# Altium schematic sheet Controller-Board.SchDoc
size Legal; PageSetup: Record=PageOptions|CenterHorizontal=True|CenterVertical=True|PrintScale=0.77|XCorrection=1.00|YCorrection=1.00|PrintKind=1|BorderSize=5000000|LeftOffset=0|BottomOffset=0|Orientation=2|PaperLength=1000|PaperWidth=1000|Scale=100|PaperSource=7|PrintQuality=-3|MediaType=1|DitherType=10|PrintScaleMode=1|PaperKind=Letter|PaperIndex=1
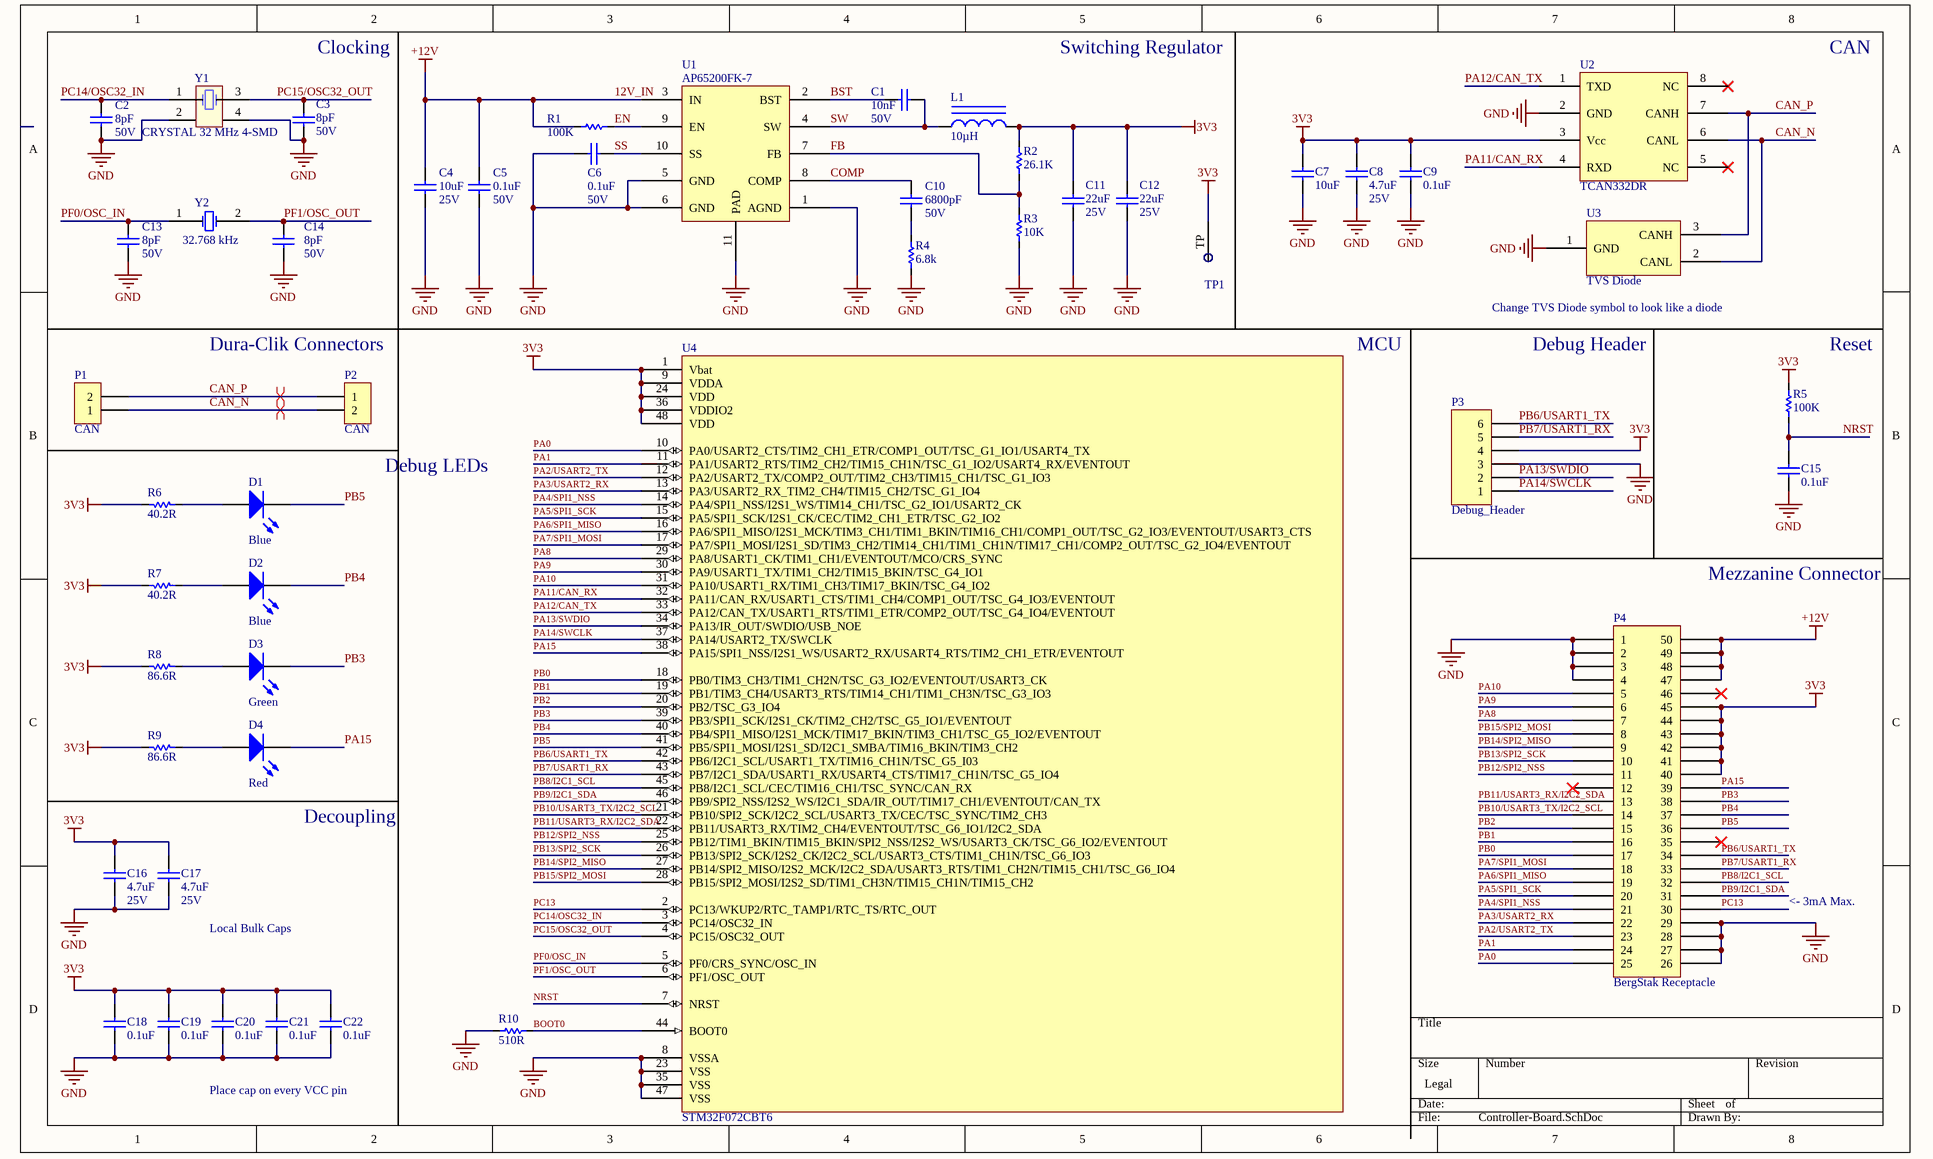
[diagram p0: Controller-Board.SchDoc]

## Parts
C1  10nF  Voltage: 50V  [CAPC1608X06N]
C2  8pF  Voltage: 50V  [CAPC1608X06N]
C3  8pF  Voltage: 50V  [CAPC1608X06N]
C4  10uF  Voltage: 25V  [CAPC1608X06N]
C5  0.1uF  Voltage: 50V  [CAPC1608X06N]
C6  0.1uF  Voltage: 50V  [CAPC1608X06N]
C7  10uF  [CAPC1608X06N]
C8  4.7uF  Voltage: 25V  [CAPC1608X06N]
C9  0.1uF  [CAPC1608X06N]
C10  6800pF  Voltage: 50V  [CAPC1608X06N]
C11  22uF  Voltage: 25V  [CAPC1608X06N]
C12  22uF  Voltage: 25V  [CAPC1608X06N]
C13  8pF  Voltage: 50V  [CAPC1608X06N]
C14  8pF  Voltage: 50V  [CAPC1608X06N]
C15  0.1uF  [CAPC1608X06N]
C16  4.7uF  Voltage: 25V  [CAPC1608X06N]
C17  4.7uF  Voltage: 25V  [CAPC1608X06N]
C18  0.1uF  [CAPC1608X06N]
C19  0.1uF  [CAPC1608X06N]
C20  0.1uF  [CAPC1608X06N]
C21  0.1uF  [CAPC1608X06N]
C22  0.1uF  [CAPC1608X06N]
D1  Blue  [DIOC1608X06N]
D2  Blue  [DIOC1608X06N]
D3  Green  [DIOC1608X06N]
D4  Red  [DIOC1608X06N]
L1  10µH  [1210]
P1  CAN  [Dura-Clik, 2POS, 2MM, SMD, Right Angle]
P2  CAN  [Dura-Clik, 2POS, 2MM, SMD, Right Angle]
P3  Debug_Header  [CONN HEADER 6POS .100" VERT TIN]
P4  BergStak Receptacle  [609-5227-1-ND]
R1  100K  [RESC1608X06N]
R2  26.1K  [RESC1608X06N]
R3  10K  [RESC1608X06N]
R4  6.8k  [RESC1608X06N]
R5  100K  [RESC1608X06N]
R6  40.2R  [RESC1608X06N]
R7  40.2R  [RESC1608X06N]
R8  86.6R  [RESC1608X06N]
R9  86.6R  [RESC1608X06N]
R10  510R  [RESC1608X06N]
TP1  Test Point  [Test Point]  (value not drawn)
U1  Manufacturer Part Number: AP65200FK-7  [10-UFDFN]  (hidden comment: AP65200FK-7 Buck Switching Regulator)
U2  Manufacturer Part Number: TCAN332DR  [SOIC8]  (hidden comment: TCAN332DR CAN Transceiver)
U3  TVS Diode  [SOT23]
U4  STM32F072CBT6  [QFN50P700X700X60_HS-49N]
Y1  CRYSTAL 32 MHz 4-SMD  [CX2520DB CRYSTAL]
Y2  32.768 kHz  [ABS07AIG CRYSTAL]

## Nets
3V3: C7.2 C8.2 C9.2 C11.2 C12.2 C16.2 C17.2 C18.2 C19.2 C20.2 C21.2 C22.2 L1.2 P3.4 P4.40 P4.41 P4.42 P4.43 P4.44 P4.45 R2.2 R5.2 R6.2 R7.2 R8.2 R9.2 TP1.TP U2.3(Vcc) U4.1(Vbat) U4.9(VDDA) U4.24(VDD) U4.36(VDDIO2) U4.48(VDD)
12V_IN: C4.2 C5.2 P4.47 P4.48 P4.49 P4.50 R1.1 U1.3(IN)  [also labelled +12V]
GND: C2.1 C3.1 C4.1 C5.1 C6.2 C7.1 C8.1 C9.1 C11.1 C12.1 C13.1 C14.1 C15.1 C16.1 C17.1 C18.1 C19.1 C20.1 C21.1 C22.1 P3.3 P4.1 P4.2 P4.3 P4.4 P4.26 P4.27 P4.28 P4.29 R3.1 R4.1 R10.1 U1.1(AGND) U1.5(GND) U1.6(GND) U1.11(PAD) U2.2(GND) U3.1(GND) U4.8(VSSA) U4.23(VSS) U4.35(VSS) U4.47(VSS) Y1.2 Y1.4
BOOT0: R10.2 U4.44(BOOT0)
BST: C1.1 U1.2(BST)
CAN_N: P1.1 P2.2 U2.6(CANL) U3.2(CANL)
CAN_P: P1.2 P2.1 U2.7(CANH) U3.3(CANH)
COMP: C10.2 U1.8(COMP)
EN: R1.2 U1.9(EN)
FB: R2.1 R3.2 U1.7(FB)
NRST: C15.2 R5.1 U4.7(NRST)
PA0: P4.25 U4.10(PA0/USART2_CTS/TIM2_CH1_ETR/COMP1_OUT/TSC_G1_IO1/USART4_TX)
PA1: P4.24 U4.11(PA1/USART2_RTS/TIM2_CH2/TIM15_CH1N/TSC_G1_IO2/USART4_RX/EVENTOUT)
PA2/USART2_TX: P4.23 U4.12(PA2/USART2_TX/COMP2_OUT/TIM2_CH3/TIM15_CH1/TSC_G1_IO3)
PA3/USART2_RX: P4.22 U4.13(PA3/USART2_RX_TIM2_CH4/TIM15_CH2/TSC_G1_IO4)
PA4/SPI1_NSS: P4.21 U4.14(PA4/SPI1_NSS/I2S1_WS/TIM14_CH1/TSC_G2_IO1/USART2_CK)
PA5/SPI1_SCK: P4.20 U4.15(PA5/SPI1_SCK/I2S1_CK/CEC/TIM2_CH1_ETR/TSC_G2_IO2)
PA6/SPI1_MISO: P4.19 U4.16(PA6/SPI1_MISO/I2S1_MCK/TIM3_CH1/TIM1_BKIN/TIM16_CH1/COMP1_OUT/TSC_G2_IO3/EVENTOUT/USART3_CTS)
PA7/SPI1_MOSI: P4.18 U4.17(PA7/SPI1_MOSI/I2S1_SD/TIM3_CH2/TIM14_CH1/TIM1_CH1N/TIM17_CH1/COMP2_OUT/TSC_G2_IO4/EVENTOUT)
PA8: P4.7 U4.29(PA8/USART1_CK/TIM1_CH1/EVENTOUT/MCO/CRS_SYNC)
PA9: P4.6 U4.30(PA9/USART1_TX/TIM1_CH2/TIM15_BKIN/TSC_G4_IO1)
PA10: P4.5 U4.31(PA10/USART1_RX/TIM1_CH3/TIM17_BKIN/TSC_G4_IO2)
PA11/CAN_RX: U2.4(RXD) U4.32(PA11/CAN_RX/USART1_CTS/TIM1_CH4/COMP1_OUT/TSC_G4_IO3/EVENTOUT)
PA12/CAN_TX: U2.1(TXD) U4.33(PA12/CAN_TX/USART1_RTS/TIM1_ETR/COMP2_OUT/TSC_G4_IO4/EVENTOUT)
PA13/SWDIO: P3.2 U4.34(PA13/IR_OUT/SWDIO/USB_NOE)
PA14/SWCLK: P3.1 U4.37(PA14/USART2_TX/SWCLK)
PA15: D4.2(K) P4.39 U4.38(PA15/SPI1_NSS/I2S1_WS/USART2_RX/USART4_RTS/TIM2_CH1_ETR/EVENTOUT)
PB0: P4.17 U4.18(PB0/TIM3_CH3/TIM1_CH2N/TSC_G3_IO2/EVENTOUT/USART3_CK)
PB1: P4.16 U4.19(PB1/TIM3_CH4/USART3_RTS/TIM14_CH1/TIM1_CH3N/TSC_G3_IO3)
PB2: P4.15 U4.20(PB2/TSC_G3_IO4)
PB3: D3.2(K) P4.38 U4.39(PB3/SPI1_SCK/I2S1_CK/TIM2_CH2/TSC_G5_IO1/EVENTOUT)
PB4: D2.2(K) P4.37 U4.40(PB4/SPI1_MISO/I2S1_MCK/TIM17_BKIN/TIM3_CH1/TSC_G5_IO2/EVENTOUT)
PB5: D1.2(K) P4.36 U4.41(PB5/SPI1_MOSI/I2S1_SD/I2C1_SMBA/TIM16_BKIN/TIM3_CH2)
PB6/USART1_TX: P3.6 P4.34 U4.42(PB6/I2C1_SCL/USART1_TX/TIM16_CH1N/TSC_G5_I03)
PB7/USART1_RX: P3.5 P4.33 U4.43(PB7/I2C1_SDA/USART1_RX/USART4_CTS/TIM17_CH1N/TSC_G5_IO4)
PB8/I2C1_SCL: P4.32 U4.45(PB8/I2C1_SCL/CEC/TIM16_CH1/TSC_SYNC/CAN_RX)
PB9/I2C1_SDA: P4.31 U4.46(PB9/SPI2_NSS/I2S2_WS/I2C1_SDA/IR_OUT/TIM17_CH1/EVENTOUT/CAN_TX)
PB10/USART3_TX/I2C2_SCL: P4.14 U4.21(PB10/SPI2_SCK/I2C2_SCL/USART3_TX/CEC/TSC_SYNC/TIM2_CH3)
PB11/USART3_RX/I2C2_SDA: P4.13 U4.22(PB11/USART3_RX/TIM2_CH4/EVENTOUT/TSC_G6_IO1/I2C2_SDA)
PB12/SPI2_NSS: P4.11 U4.25(PB12/TIM1_BKIN/TIM15_BKIN/SPI2_NSS/I2S2_WS/USART3_CK/TSC_G6_IO2/EVENTOUT)
PB13/SPI2_SCK: P4.10 U4.26(PB13/SPI2_SCK/I2S2_CK/I2C2_SCL/USART3_CTS/TIM1_CH1N/TSC_G6_IO3)
PB14/SPI2_MISO: P4.9 U4.27(PB14/SPI2_MISO/I2S2_MCK/I2C2_SDA/USART3_RTS/TIM1_CH2N/TIM15_CH1/TSC_G6_IO4)
PB15/SPI2_MOSI: P4.8 U4.28(PB15/SPI2_MOSI/I2S2_SD/TIM1_CH3N/TIM15_CH1N/TIM15_CH2)
PC13: P4.30 U4.2(PC13/WKUP2/RTC_TAMP1/RTC_TS/RTC_OUT)
PC14/OSC32_IN: C2.2 U4.3(PC14/OSC32_IN) Y1.1(OSC1)
PC15/OSC32_OUT: C3.2 U4.4(PC15/OSC32_OUT) Y1.3(OSC2)
PF0/OSC_IN: C13.2 U4.5(PF0/CRS_SYNC/OSC_IN) Y2.1
PF1/OSC_OUT: C14.2 U4.6(PF1/OSC_OUT) Y2.2
SS: C6.1 U1.10(SS)
SW: C1.2 L1.1 U1.4(SW)
NetC10_1: C10.1 R4.2
NetD1_1: D1.1(A) R6.1
NetD2_1: D2.1(A) R7.1
NetD3_1: D3.1(A) R8.1
NetD4_1: D4.1(A) R9.1

Not connected (* = marked no-connect by the designer): P4 12* 35* 46*; U2 5(NC)* 8(NC)*

## Layout directives
differential pair: CAN_N, CAN_P

## Notes on the sheet
- Clocking
- Switching Regulator
- CAN
- (near P2) Dura-Clik Connectors
- MCU
- (near U3) Change TVS Diode symbol to look like a diode
- Debug Header
- (near R5) Reset
- Debug LEDs
- Mezzanine Connector
- Decoupling
- <- 3mA Max.
- Local Bulk Caps
- Place cap on every VCC pin

## Library data of the parts
C1 = CAP CER 10nF 50V 5% X7R 0603: 10000pF ±5% 50V Ceramic Capacitor U2J 0603 (1608 Metric); Manufacturer: Kemet; ManufacturerPartNumber: C0603C103J5JAC7867; Value: 10nF; Supplier: Digi-Key; SupplierPartNumber: 399-13384-1-ND
C2 C3 C13 C14 = CAP CER 8PF 50V NP0 0603: 8pF ±0.5pF 50V Ceramic Capacitor C0G, NP0 0603 (1608 Metric); Manufacturer: Murata Electronics North America; ManufacturerPartNumber: GRM1885C1H8R0DA01D; Value: 8pF; Supplier: Digi-Key; SupplierPartNumber: 490-9670-1-ND
C4 C7 = CAP CER 10uF 25V 20% X5R 0603: 10µF ±20% 25V Ceramic Capacitor X5R 0603 (1608 Metric); Manufacturer: Murata Electronics North America; ManufacturerPartNumber: GRM188R61E106MA73D; Value: 10uF; Supplier: Digi-Key; SupplierPartNumber: 490-7202-1-ND
  C7: Voltage: 25V
C5 C6 C9 C15 C18-C22 = CAP CER 0.1UF 50V 10% X7R 0603: 0.10µF ±10% 50V Ceramic Capacitor X7R 0603 (1608 Metric); Manufacturer: AVX Corporation; ManufacturerPartNumber: 06035C104KAT2A; Value: 0.1uF; Supplier: Digi-Key; SupplierPartNumber: 478-5052-1-ND
  C9 C15 C18-C22: Voltage: 50V
C8 C16 C17 = CAP CER 4.7UF 25V 10% X5R 0603: 4.7µF ±10% 25V Ceramic Capacitor X5R 0603 (1608 Metric); Manufacturer: Murata Electronics North America; ManufacturerPartNumber: GRM188R61E475KE11D; Value: 4.7uF; Supplier: Digi-Key; SupplierPartNumber: 490-7203-1-ND
C10 = CAP CER 6800pF 50V 10% X7R 0603: 6800pF ±10% 50V Ceramic Capacitor X7R 0603 (1608 Metric); Manufacturer: Samsung Electro-Mechanics America, Inc.; ManufacturerPartNumber: CL10B682KB8SFNC; Value: 6800pF; Supplier: Digi-Key; SupplierPartNumber: 1276-2103-1-ND
C11 C12 = CAP CER 22uF 25V 20% X5R 0603: 0.22µF ±20% 25V Ceramic Capacitor X5R 0603 (1608 Metric); Manufacturer: Wurth Electronics Inc; ManufacturerPartNumber: 885012106019; Value: 22uF; Supplier: Digi-Key; SupplierPartNumber: 732-7916-1-ND
D1 D2 = LED_BLUE: LED BLUE CLEAR 0603 SMD; Manufacturer: Lite-On Inc.; Manufacturer Part Number: LTST-C193TBKT-5A; Forward Voltage: 2.8V; DC Foward Current: 20mA; Digikey Part Number: 160-1827-1-ND; Color: Blue
D3 = LED_GREEN: LED GREEN CLEAR 0603 SMD; Manufacturer: Lite-On Inc.; Manufacturer Part Number: LTST-C193KGKT-5A; Forward Voltage: 2.0V; DC Forward Current: 30mA; Package: 0603; Color: Green; Supplier: Digi-Key; Supplier Part Number: 160-1828-1-ND
D4 = LED_RED: Red LED 0603; Manufacture: Lite-On Inc.; Manufacture Part Number: LTST-C191KRKT; Forward Voltage: 2.0V; DC Forward Current: 30mA; Package: 0603; Color: Red; Supplier: Digi-Key; Supplier Part Number: 160-1447-1-ND
L1 = IND 10UH POWDERED IRON 0.9A: 10µH Shielded Wirewound Inductor 900mA 420 mOhm Max 1210 (3225 Metric); Manufacturer: Murata Electronics North America; Manufacturer Part Number: 1277AS-H-100M=P2; Tolerance: ±20%; Current Rating: 0.9A; Current - Saturation: 1.25A; Supplier 1: Digi-Key; Supplier Part Number 1: 490-10589-1-ND; Type: Wirewound; Shielding: Shielded; DC Resistance (DCR): 420 mOhm Max; Height - Seated (Max): 0.047" (1.20mm); ComponentLink1URL: http://www.toko.co.jp/products-murata/pdf/inductors/m_dfe322512c.pdf; ComponentLink1Description: datasheet; Inductance: 10µH
P1 P2 = 2 Position DuraClik CAN Connector: 2 Positions Header, Shrouded Connector 0.079" (2.00mm) Surface Mount, Right Angle Tin; Manufacturer: Molex; Manufacturer Part Number: 5023520200; Supplier: Digi-Key; Supplier Part Number: WM7169CT-ND
P3 = CONN HEADER 6POS .100 STR TIN: 6 Positions Header, Unshrouded, Breakaway Connector 0.100" (2.54mm) Surface Mount Tin; Manufacturer: Molex, LLC; Manufacturer Part Number: 0015912060; Supplier: Digikey; Supplier Part Number: WM17449-ND
P4 = BergStak 50 Position Connector Receptacle: 50 Position Connector Receptacle, Center Strip Contacts Surface Mount Gold; Manufacturer Part Number: 10132798-052100LF; Digikey Part Number: 609-5227-1-ND; Supplier 1: Digi-Key; Supplier Part Number 1: 609-5227-1-ND
R1 R5 = RES 100K OHM 1/8W 5% 0603 SMD: RES SMD 100K OHM 5% 1/10W 0603; ManufacturerPartNumber: RC0603JR-07100KL; Manufacturer: Yageo; Value: 100K; Supplier: Digi-Key; SupplierPartNumber: 311-100KGRCT-ND
R2 = RES 26.1K OHM 1/10W 1% 0603 SMD: RES SMD 26.1K OHM 1% 1/10W 0603; ManufacturerPartNumber: RC0603FR-0726K1L; Manufacturer: Yageo; Value: 26.1K; Supplier: Digi-Key; SupplierPartNumber: 311-26.1KHRCT-ND
R3 = RES SMD 10K OHM 1% 1/10W 0603: Manufacture: Yageo; Manufacture Part Number: RC0603FR-0710KL; Tolerance: 1%; Power: 1/10W; Package: 0603; Supplier: Digi-Key; Supplier Part Number: 311-10.0KHRTR-ND; Value: 10K
R4 = RES 6.8k OHM 1% 1/10W 0603 SMD: RES SMD 6.8K OHM 1% 1/10W 0603; ManufacturerPartNumber: RMCF0603FT6K80; Manufacturer: Stackpole Electronics Inc.; Value: 6.8k; Supplier: Digi-Key; Supplier Part Number: RMCF0603FT6K80CT-ND
R6 R7 = RES 40.2 OHM 0.5% 1/10W 0603 SMD: RES SMD 40.2 OHM 0.5% 1/10W 0603; ManufacturerPartNumber: RT0603DRE0740R2L; Manufacturer: Yageo; Value: 40.2R; Supplier: Digi-Key; Supplier Part Number: 311-2576-1-ND
R8 R9 = RES 86.6 OHM 1% 1/10W 0603 SMD: RES SMD 86.6 OHM 1% 1/10W 0603; ManufacturerPartNumber: RC0603FR-0786R6L; Manufacturer: Yageo; Value: 86.6R; Supplier: Digi-Key; Supplier Part Number: YAG3330CT-ND
R10 = RES 510 OHM 1/10W 0603 SMD: RES SMD 510 OHM 5% 1/10W 0603; ManufacturerPartNumber: RC0603JR-07510RL; Manufacturer: Yageo; Value: 510R; Supplier: Digi-Key; SupplierPartNumber: 311-510GRCT-ND
U1 = AP65200FK-7 Buck Switching Regulator: Buck Switching Reg IC Positive Adjustable 0.925V 1 Output 2A 10-UFDFN Exposed Pad; Digikey Part Number: AP65200FK-7DICT-ND; Supplier 1: Digi-Key; Supplier Part Number 1: AP65200FK-7DICT-ND
U2 = TCAN332DR CAN Transceiver: 1/1 Transceiver CAN 8-SOIC; Digikey Part Number: 296-43711-1-ND; Supplier 1: Digi-Key; Supplier Part Number 1: 296-43711-1-ND
Y1 = CRYSTAL 32 MHz 4-SMD: 32MHz ±15ppm Crystal 8pF 50 Ohm -40°C ~ 85°C AEC-Q200 Surface Mount 4-SMD, No Lead; Manufacturer PN: CX2520DB32000D0GPSC1; Manfacturer: AVX Corp/Kyocera Corp; Supplier: Digikey; Supplier PN: 1253-1730-1-ND
Y2 = CRYSTAL 32.768KHZ 9PF 2-SMD: 32.768kHz ±20ppm Crystal 6pF 50 kOhm -40°C ~ 85°C Surface Mount 4-SOJ, 5.50mm pitch; Manufacturer Part Number: ABS07AIG-32.768KHZ-9-1-T; Supplier: Digi-Key; Supplier Part Number: 535-13353-1-ND; VALUE: 32.768 kHz
U4 = STM32F072CBT6: Digikey Part Number: 497-14645-ND; Supplier: Digi-Key; Supplier Part Number: 497-14645-ND; Manufacturer Part Number: STM32F072CBT6